# Altium schematic sheet schematic_rovables_master_v1.SchDoc: Rovables Master
size A; Author: Artem Dementyev; Revision: 1; Designer: Artem Dementyev
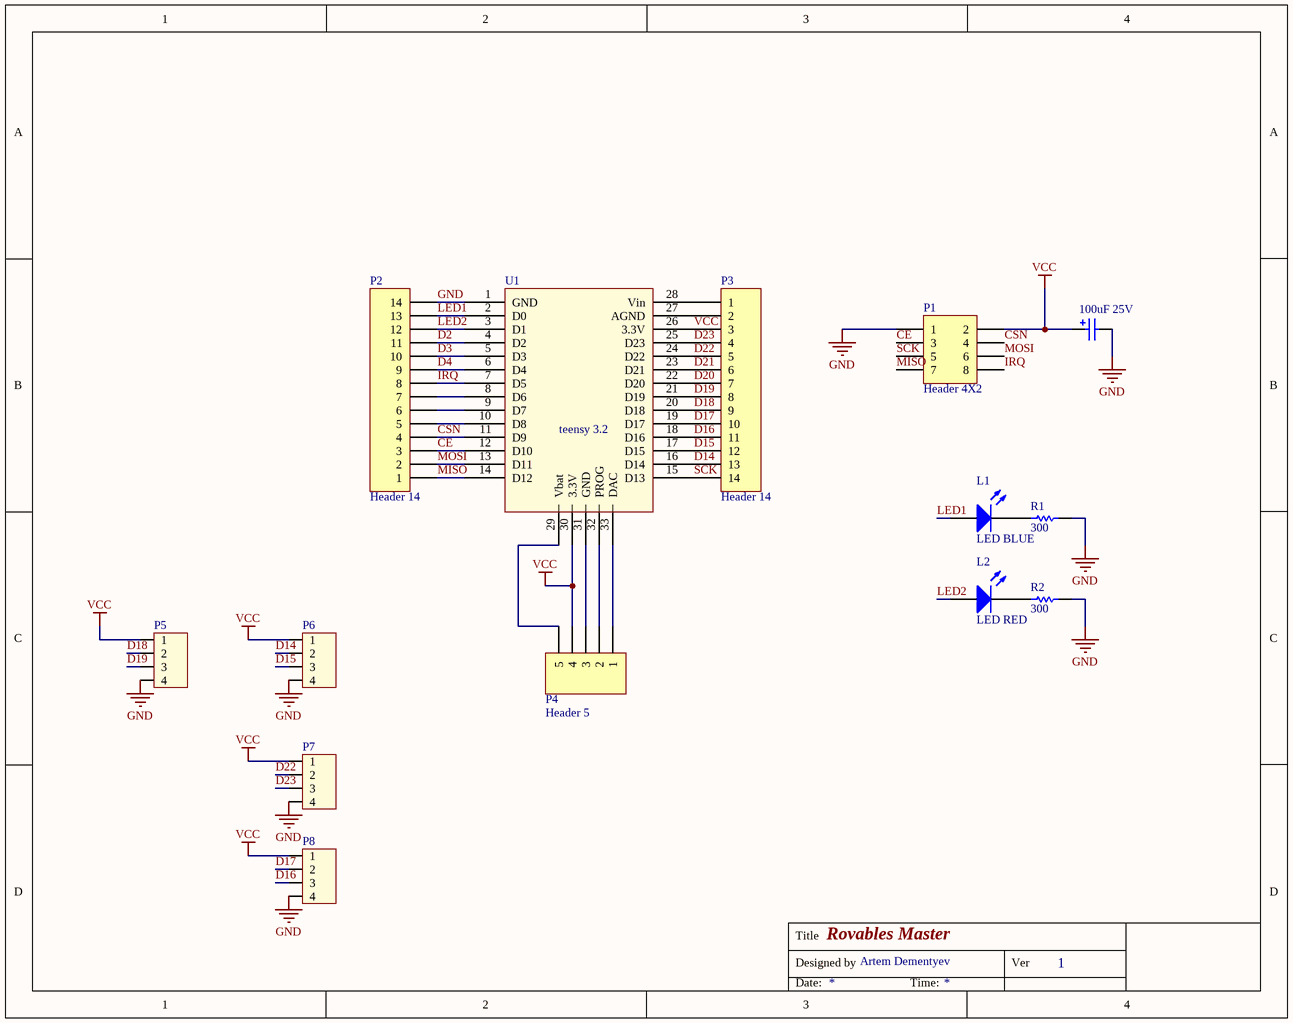
[diagram p0: schematic_rovables_master_v1.SchDoc]

## Parts
100uF_25V  Electrolytic Cap 100uF smd  [F80 Electrolytic cap]  (value not drawn)
L1  LED BLUE  [RES_1206_SMD]
L2  LED RED  [RES_1206_SMD]
P1  Header 4X2  [HDR2X4]
P2  Header 14  [HDR1X14]
P3  Header 14  [HDR1X14]
P4  Header 5  [HDR1X5]
P5  JST SH 4 SIDE  [JST SH 4 TOP ENTRY]  (value not drawn)
P6  JST SH 4 SIDE  [JST SH 4 TOP ENTRY]  (value not drawn)
P7  JST SH 4 SIDE  [JST SH 4 TOP ENTRY]  (value not drawn)
P8  JST SH 4 SIDE  [JST SH 4 TOP ENTRY]  (value not drawn)
R1  300  [RES_1206_SMD]
R2  300  [RES_1206_SMD]
U1  teensy 3.2  [Teensy 3.2]

## Nets
GND: 100uF_25V.2 P1.1 P2.14 P5.4 P6.4 P7.4 P8.4 R1.2 R2.2 U1.1(GND)
VCC: 100uF_25V.1 P1.2 P3.3 P4.4 P5.1 P6.1 P7.1 P8.1 U1.26(3.3V) U1.30(3.3V)
CE: P1.3 P2.3 U1.12(D10)
CSN: P1.4 P2.4 U1.11(D9)
D2: P2.11 U1.4(D2)
D3: P2.10 U1.5(D3)
D4: P2.9 U1.6(D4)
D14: P3.13 P6.2 U1.16(D14)
D15: P3.12 P6.3 U1.17(D15)
D16: P3.11 P8.3 U1.18(D16)
D17: P3.10 P8.2 U1.19(D17)
D18: P3.9 P5.2 U1.20(D18)
D19: P3.8 P5.3 U1.21(D19)
D20: P3.7 U1.22(D20)
D21: P3.6 U1.23(D21)
D22: P3.5 P7.2 U1.24(D22)
D23: P3.4 P7.3 U1.25(D23)
IRQ: P1.8 P2.8 U1.7(D5)
LED1: L1.1(A) P2.13 U1.2(D0)
LED2: L2.1(A) P2.12 U1.3(D1)
MISO: P1.7 P2.1 U1.14(D12)
MOSI: P1.6 P2.2 U1.13(D11)
SCK: P1.5 P3.14 U1.15(D13)
NetL1_2: L1.2(K) R1.1
NetL2_2: L2.2(K) R2.1
NetP2_5: P2.5 U1.10(D8)
NetP2_6: P2.6 U1.9(D7)
NetP2_7: P2.7 U1.8(D6)
NetP3_1: P3.1 U1.28(Vin)
NetP3_2: P3.2 U1.27(AGND)
NetP4_1: P4.1 U1.33(DAC)
NetP4_2: P4.2 U1.32(PROG)
NetP4_3: P4.3 U1.31(GND)
NetP4_5: P4.5 U1.29(Vbat)

## Notes on the sheet
- Title
- Designed by
- Ver
- Date:
- Time:

## Library data of the parts
100uF_25V = Electrolytic Cap 100uF smd: 100uF 25 VSMD; manufacturer: United Chemi-Con; manufacturer part number: EMZA250ADA101MF80G; digikey part number: 565-2549-1-ND
L1 L2 = LED: LED SMD 1206/0603; digikey part number: *; manufacturer part number: *; manufacturer: *
P1 = Header 4X2: Header, 4-Pin, Dual row; LatestRevisionDate: 17-Jul-2002; LatestRevisionNote: Re-released for DXP Platform.; Publisher: Altium Limited
P2 P3 = Header 14: Header, 14-Pin; LatestRevisionDate: 17-Jul-2002; LatestRevisionNote: Re-released for DXP Platform.; Publisher: Altium Limited
P4 = Header 5: Header, 5-Pin; LatestRevisionDate: 17-Jul-2002; LatestRevisionNote: Re-released for DXP Platform.; Publisher: Altium Limited
P5-P8 = JST SH 4 SIDE: manufacturer part number: SM04B-SRSS-TB(LF)(SN); digikey part number: 455-1804-1-ND; manufacturer: JST
R1 R2 = Resistor: digikey part number: *; manufacturer: *; manufacturer part number: *